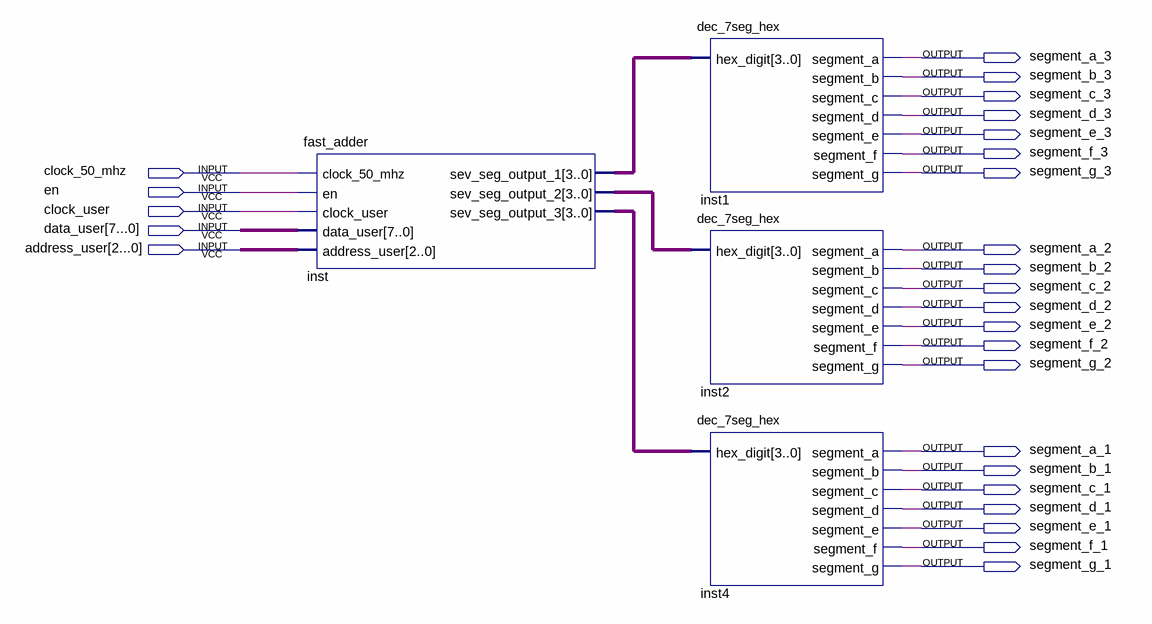
[diagram p0: schematic sheet]
// Quartus schematic fast_adder.bdf as structural Verilog: 4 symbols, 26 pins
module fast_adder (
  input  clock_50_mhz,
  input  en,
  input  clock_user,
  input  \data_user[7...0] ,
  input  \address_user[2...0] ,
  output segment_a_3,
  output segment_b_3,
  output segment_c_3,
  output segment_d_3,
  output segment_e_3,
  output segment_f_3,
  output segment_g_3,
  output segment_a_2,
  output segment_b_2,
  output segment_c_2,
  output segment_d_2,
  output segment_e_2,
  output segment_f_2,
  output segment_g_2,
  output segment_a_1,
  output segment_b_1,
  output segment_c_1,
  output segment_d_1,
  output segment_e_1,
  output segment_f_1,
  output segment_g_1
);

  wire [2:0] undriven_2;
  wire [3:0] inst_sev_seg_output_1, inst_sev_seg_output_2, inst_sev_seg_output_3;
  wire [7:0] undriven;

  fast_adder inst (
    .clock_50_mhz(clock_50_mhz), .en(en), .clock_user(clock_user), .data_user(undriven),
    .address_user(undriven_2), .sev_seg_output_1(inst_sev_seg_output_1),
    .sev_seg_output_2(inst_sev_seg_output_2), .sev_seg_output_3(inst_sev_seg_output_3));
  dec_7seg_hex inst1 (
    .hex_digit(inst_sev_seg_output_1), .segment_a(segment_a_3), .segment_b(segment_b_3),
    .segment_c(segment_c_3), .segment_d(segment_d_3), .segment_e(segment_e_3), .segment_f(segment_f_3),
    .segment_g(segment_g_3));
  dec_7seg_hex inst2 (
    .hex_digit(inst_sev_seg_output_2), .segment_a(segment_a_2), .segment_b(segment_b_2),
    .segment_c(segment_c_2), .segment_d(segment_d_2), .segment_e(segment_e_2), .segment_f(segment_f_2),
    .segment_g(segment_g_2));
  dec_7seg_hex inst4 (
    .hex_digit(inst_sev_seg_output_3), .segment_a(segment_a_1), .segment_b(segment_b_1),
    .segment_c(segment_c_1), .segment_d(segment_d_1), .segment_e(segment_e_1), .segment_f(segment_f_1),
    .segment_g(segment_g_1));
endmodule
